# EAGLE design Pedal Box Board rev2.1 (EAGLE 7.7.0)
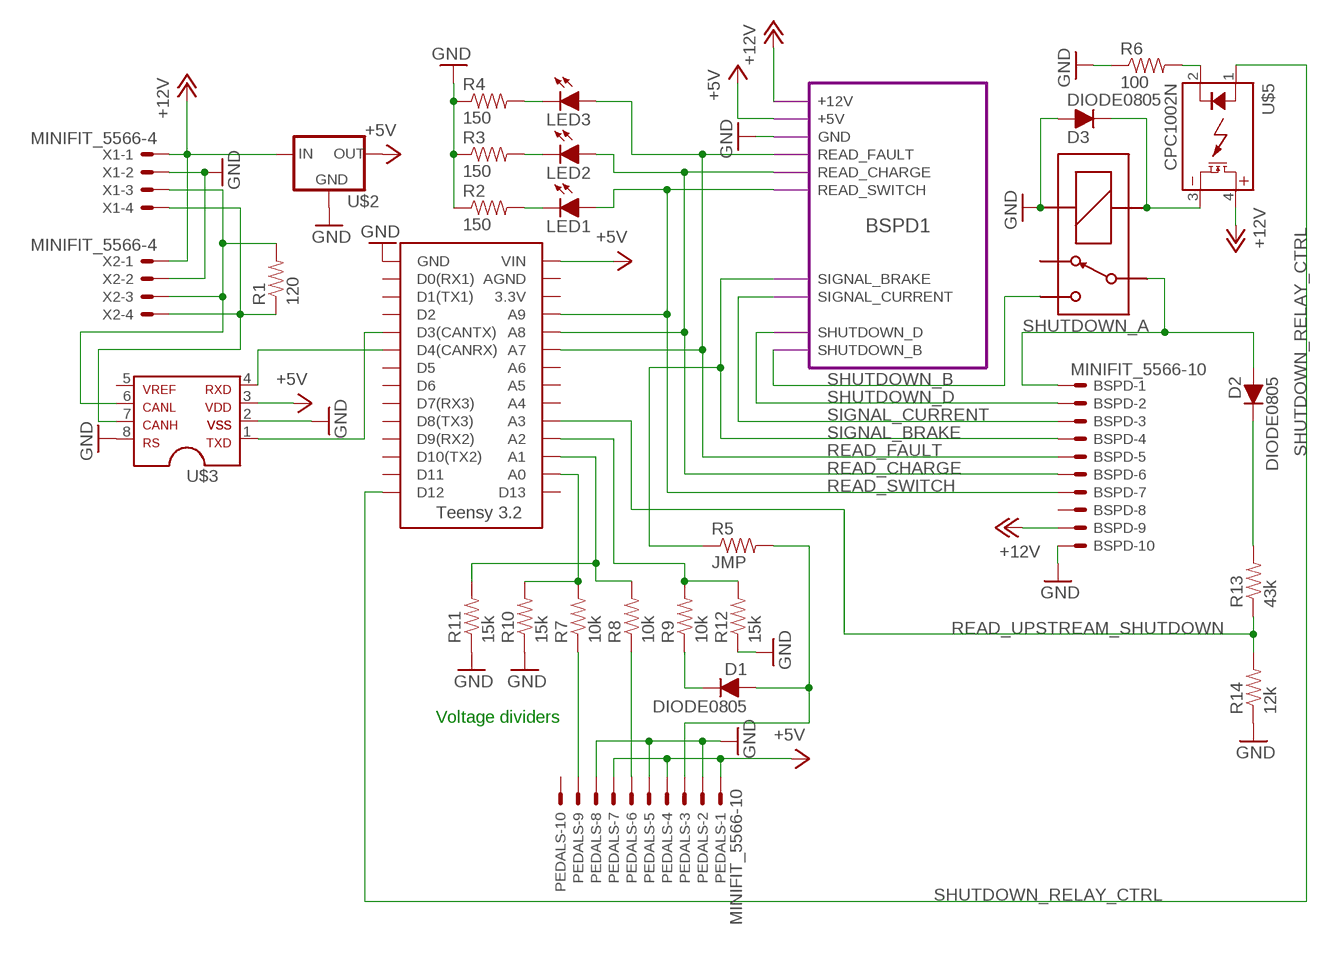
[diagram p0: schematic, sheet 1]

## Parts
BSPD  MINIFIT_5566-10  [MINIFIT_5566-10]
D1  DIODE0805  [0805_D]
D2  DIODE0805  [0805_D]
D3  DIODE0805  [0805_D]
LED1  LED-0805  [LED-805]
LED2  LED-0805  [LED-805]
LED3  LED-0805  [LED-805]
PEDALS  MINIFIT_5566-10  [MINIFIT_5566-10]
R1  120  RESISTOR0805-RES  [0805]
R2  150  RESISTOR0805-RES  [0805]
R3  150  RESISTOR0805-RES  [0805]
R4  150  RESISTOR0805-RES  [0805]
R5  JMP  RESISTORPTH-1/4W-VERT  [AXIAL-0.1]
R6  100  RESISTOR0805-RES  [0805]
R7  10k  RESISTOR0805-RES  [0805]
R8  10k  RESISTOR0805-RES  [0805]
R9  10k  RESISTOR0805-RES  [0805]
R10  15k  RESISTOR0805-RES  [0805]
R11  15k  RESISTOR0805-RES  [0805]
R12  15k  RESISTOR0805-RES  [0805]
R13  43k  RESISTOR0805-RES  [0805]
R14  12k  RESISTOR0805-RES  [0805]
SOFTWARE_SHUTOFF  G5LE  [ZF112]
U$1  TEENSY_3.2_SIMPLE  [TEENSY_3.2_SIMPLE]
U$2  5VREG_LM340-NLM340MPX-5.0/NOPB  [SOT223]
U$3  MCP2551  [SOIC-08]
U$5  CPC1002N  [SOP04]
X1  MINIFIT_5566-4  [MINIFIT_5566-4]
X2  MINIFIT_5566-4  [MINIFIT_5566-4]

## Module instances
BSPD1 = BSPD

## Nets
+5V: PEDALS.1 PEDALS.4 PEDALS.7 U$1.VIN U$2.3(OUT) U$3.3 ; port BSPD1.+5V
+12V: BSPD.9 U$2.1(IN) U$5.4(DC+) X1.1 X2.1 ; port BSPD1.+12V
GND: BSPD.10 D3.A PEDALS.2 PEDALS.5 PEDALS.8 R2.1 R3.1 R4.1 R6.1 R10.1 R11.1 R12.1 R14.1 SOFTWARE_SHUTOFF.1(COIL+) U$1.GND U$2.2(GND) U$2.4(GND) U$3.2 U$3.8 X1.2 X2.2 ; port BSPD1.GND
N$1: PEDALS.9 R7.1
N$2: U$1.D4(CANRX) U$3.4
N$3: R1.2 U$3.6 X1.3 X2.3
N$4: R1.1 U$3.7 X1.4 X2.4
N$5: U$1.D3(CANTX) U$3.1
N$6: R8.2 R11.2 U$1.A1
N$7: D1.C R9.1
N$8: PEDALS.6 R8.1
N$9: R7.2 R10.2 U$1.A0
N$10: R9.2 R12.2 U$1.A2
N$11: D1.A PEDALS.3 R5.P$2
N$12: D3.C SOFTWARE_SHUTOFF.2(COIL-) U$5.3(DC-)
N$13: D2.C R13.2
N$14: LED1.C R2.2
N$15: LED2.C R3.2
N$16: LED3.C R4.2
N$22: R6.2 U$5.2(CONTROL-)
READ_CHARGE: BSPD.6 LED2.A U$1.A8 ; port BSPD1.READ_CHARGE
READ_FAULT: BSPD.5 LED3.A U$1.A7 ; port BSPD1.READ_FAULT
READ_SWITCH: BSPD.7 LED1.A U$1.A9 ; port BSPD1.READ_SWITCH
READ_UPSTREAM_SHUTDOWN: R13.1 R14.2 U$1.A3
SHUTDOWN_A: BSPD.1 D2.A SOFTWARE_SHUTOFF.P
SHUTDOWN_B: SOFTWARE_SHUTOFF.S ; port BSPD1.SHUTDOWN_B
SHUTDOWN_D: BSPD.2 ; port BSPD1.SHUTDOWN_D
SHUTDOWN_RELAY_CTRL: U$1.D12 U$5.1(CONTROL+)
SIGNAL_BRAKE: BSPD.4 R5.P$1 ; port BSPD1.SIGNAL_BRAKE
SIGNAL_CURRENT: BSPD.3 ; port BSPD1.SIGNAL_CURRENT
Unconnected: BSPD.8 PEDALS.10 SOFTWARE_SHUTOFF.O U$1.3.3V U$1.A4 U$1.A5 U$1.A6 U$1.AGND U$1.D0(RX1) U$1.D1(TX1) U$1.D2 U$1.D5 U$1.D6 U$1.D7(RX3) U$1.D8(TX3) U$1.D9(RX2) U$1.D10(TX2) U$1.D11 U$1.D13 U$3.5

## Notes on the sheet
- Voltage dividers

## Library data of the parts
BSPD PEDALS = HyTechDevices:MINIFIT_5566-10: Mini-Fit Junior connector 10 pole Source: http://www.molex.com; OC_FARNELL: unknown; OC_NEWARK: unknown
D1-D3 = HyTechDevices:DIODE: DIODE general purpose rectifier
LED1-LED3 = HyTechDevices:LED: Light Emitting Diode (LED) Source: Dangerous Prototypes Eagle Library <https://github.com/DangerousPrototypes/Eagle_Part_Library>
R1-R14 = HyTechDevices:RESISTOR: Resistor Basic schematic elements and footprints for 0603, 1206, and PTH resistors.
SOFTWARE_SHUTOFF = HyTechDevices:G5LE: Omron G5LE SPST Relay 5 VDC, 12VDC, 24VDC models Coil voltage: 75% - 170% of nominal voltage Datasheet <https://www.omron.com/ecb/products/pdf/en-g5le.pdf>
U$1 = HyTechDevices:TEENSY_3.2_SIMPLE: Simple version of the Teensy 3.2 board that only uses the 2 main rows of pins, not the inner pins or the pins opposite the usb port.
U$2 = HyTechDevices:5VREG_LM340-N: Voltage Regulator 5v linear voltage regulator Datasheet <http://www.mouser.com/ProductDetail/Texas-Instruments/LM340MPX-50-NOPB/?qs=X1J7HmVL2ZGZwtTFRQ9ItA%3D%3D> MAX current out: 1.5A MAX voltage in: 35V
U$3 = HyTechDevices:MCP2551: MCP2551 High-Speed CAN Transceiver Product Webpage <https://www.microchip.com/wwwproducts/en/MCP2551> Datasheet <http://ww1.microchip.com/downloads/en/DeviceDoc/21667f.pdf> This device is outdated It is replaced by MCP2561. Comparison Page <https://www.microchip.com/wwwproducts/ProductCompare/MCP2551/MCP2561> Product Webpage <https://www.microchip.com/wwwproducts/en/MCP2561> Datasheet <http://ww1.microchip.com/downloads/en/DeviceDoc/20005167C.pdf>
U$5 = HyTechDevices:CPC1002N: IXYS Solid State Relay .7A
X1 X2 = HyTechDevices:MINIFIT_5566-4: Mini-Fit Junior connector 4 pole Source: http://www.molex.com; OC_FARNELL: unknown; OC_NEWARK: unknown

## Module BSPD
Ports: GND(out) +5V(in) READ_CHARGE(out) SHUTDOWN_B(in) READ_SWITCH(out) READ_FAULT(out) SHUTDOWN_D(out) SIGNAL_BRAKE(in) SIGNAL_CURRENT(in) +12V(in)
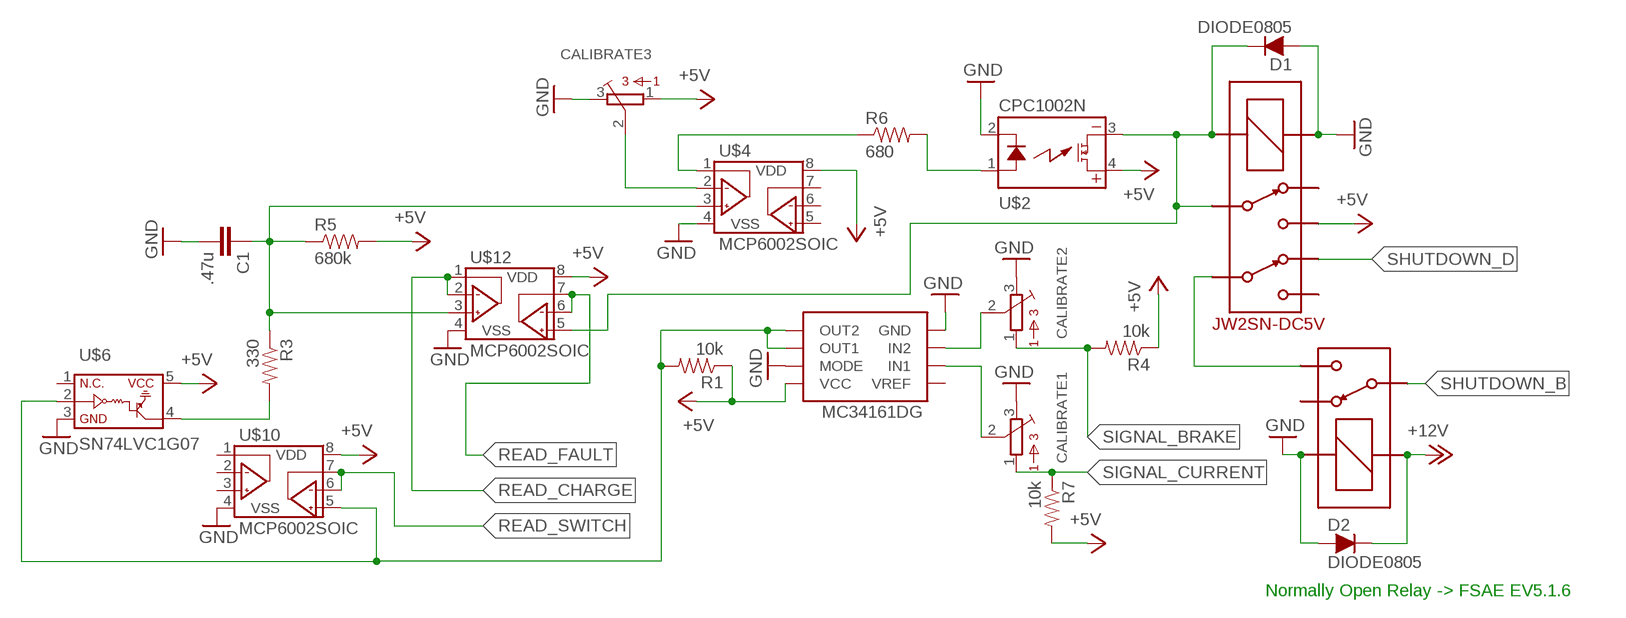
[diagram p1: schematic, module BSPD, sheet 1]

### Parts
C1  .47u  CAPEZ  [CAP-PTH-SMALLEZ]
CALIBRATE1  TRIMPOT_3296C  [TRIMPOT_3296]
CALIBRATE2  TRIMPOT_3296C  [TRIMPOT_3296]
CALIBRATE3  TRIMPOT_3296C  [TRIMPOT_3296]
D1  DIODE0805  [0805_D]
D2  DIODE0805  [0805_D]
MC34161DG  MC34161DG  [SOIC-08]
R1  10k  RESISTOR0805-RES  [0805]
R3  330  RESISTOR0805-RES  [0805]
R4  10k  RESISTOR0805-RES  [0805]
R5  680k  RESISTOREZ  [AXIAL-0.3EZ]
R6  680  RESISTOR0805-RES  [0805]
R7  10k  RESISTOR0805-RES  [0805]
U$1  G5LE  [ZF112]
U$2  CPC1002N  [SOP04]
U$3  JW2SN-DC5V  [JW2SN]
U$4  MCP6002SOIC  [SOIC-08]
U$6  SN74LVC1G07  [SOT-23-5]
U$10  MCP6002SOIC  [SOIC-08]
U$12  MCP6002SOIC  [SOIC-08]

### Nets
+5V: CALIBRATE3.1 MC34161DG.8(VCC) R1.1 R4.1 R5.P$2 R7.2 U$2.4(DC+) U$3.4 U$4.8(VDD) U$6.5 U$10.8(VDD) U$12.8(VDD)
+12V: D2.C U$1.2(COIL-)
GND: C1.2 CALIBRATE1.3 CALIBRATE2.3 CALIBRATE3.3 D1.A D2.A MC34161DG.4(GND) MC34161DG.7(MODE) U$1.1(COIL+) U$2.2(CONTROL-) U$3.COIL+ U$4.4(VSS) U$6.3 U$10.4(VSS) U$12.4(VSS)
N$1: D1.C U$2.3(DC-) U$3.3 U$3.COIL- U$12.5(VINB+)
N$2: R3.2 U$6.4
N$3: R6.2 U$2.1(CONTROL+)
N$5: CALIBRATE2.2 MC34161DG.3(IN2)
N$6: CALIBRATE1.2 MC34161DG.2(IN1)
N$7: CALIBRATE3.2 U$4.2(VINA-)
N$9: R6.1 U$4.1(VOUTA)
N$10: MC34161DG.5(OUT2) MC34161DG.6(OUT1) R1.2 U$6.2 U$10.5(VINB+)
N$13: C1.1 R3.1 R5.P$1 U$4.3(VINA+) U$12.3(VINA+)
READ_CHARGE: U$12.1(VOUTA) U$12.2(VINA-)
READ_FAULT: U$12.6(VINB-) U$12.7(VOUTB)
READ_SWITCH: U$10.6(VINB-) U$10.7(VOUTB)
SHUTDOWN_B: U$1.P
SHUTDOWN_C: U$1.S U$3.6
SHUTDOWN_D: U$3.7
SIGNAL_BRAKE: CALIBRATE2.1 R4.2
SIGNAL_CURRENT: CALIBRATE1.1 R7.1
Unconnected: MC34161DG.1(VREF) U$1.O U$3.2 U$3.5 U$4.5(VINB+) U$4.6(VINB-) U$4.7(VOUTB) U$6.1 U$10.1(VOUTA) U$10.2(VINA-) U$10.3(VINA+)

### Notes on the sheet
- Normally Open Relay -> FSAE EV5.1.6

### Library data of the parts
C1 = HyTechDevices:CAP: Capacitor Standard 0603 ceramic capacitor, and 0.1" leaded capacitor.
CALIBRATE1-CALIBRATE3 = HyTechDevices:TRIMPOT_3296: 3296 Series 3/8" Square Trimmer Source <https://github.com/chiengineer/Eagle-Libraries/blob/master/Potentiometers/bourns.lbr>
D1 D2 = HyTechDevices:DIODE: DIODE general purpose rectifier
MC34161DG = HyTechDevices:MC34161DG: ON Semiconductor MC34161 Dual Channel Voltage Monitor
R1 R3-R7 = HyTechDevices:RESISTOR: Resistor Basic schematic elements and footprints for 0603, 1206, and PTH resistors.
U$1 = HyTechDevices:G5LE: Omron G5LE SPST Relay 5 VDC, 12VDC, 24VDC models Coil voltage: 75% - 170% of nominal voltage Datasheet <https://www.omron.com/ecb/products/pdf/en-g5le.pdf>
U$2 = HyTechDevices:CPC1002N: IXYS Solid State Relay .7A
U$3 = HyTechDevices:JW2SN-DC5V: Panasonic Double Pull Double Throw Relay 5VDC Datasheet <http://www.mouser.com/ds/2/316/jw-catalog-461998.pdf> Product Page <http://www.mouser.com/ProductDetail/Panasonic-Industrial-Devices/JW2SN-DC5V>
U$4 U$10 U$12 = HyTechDevices:MCP6002: Microchip MCP6002 Dual Channel Op Amp
U$6 = HyTechDevices:SN74LVC1G07: TI SN74LVC1G07 Single Buffer/Driver With Open-Drain Output Datasheet <http://www.ti.com/lit/ds/symlink/sn74lvc1g07.pdf>

## Board
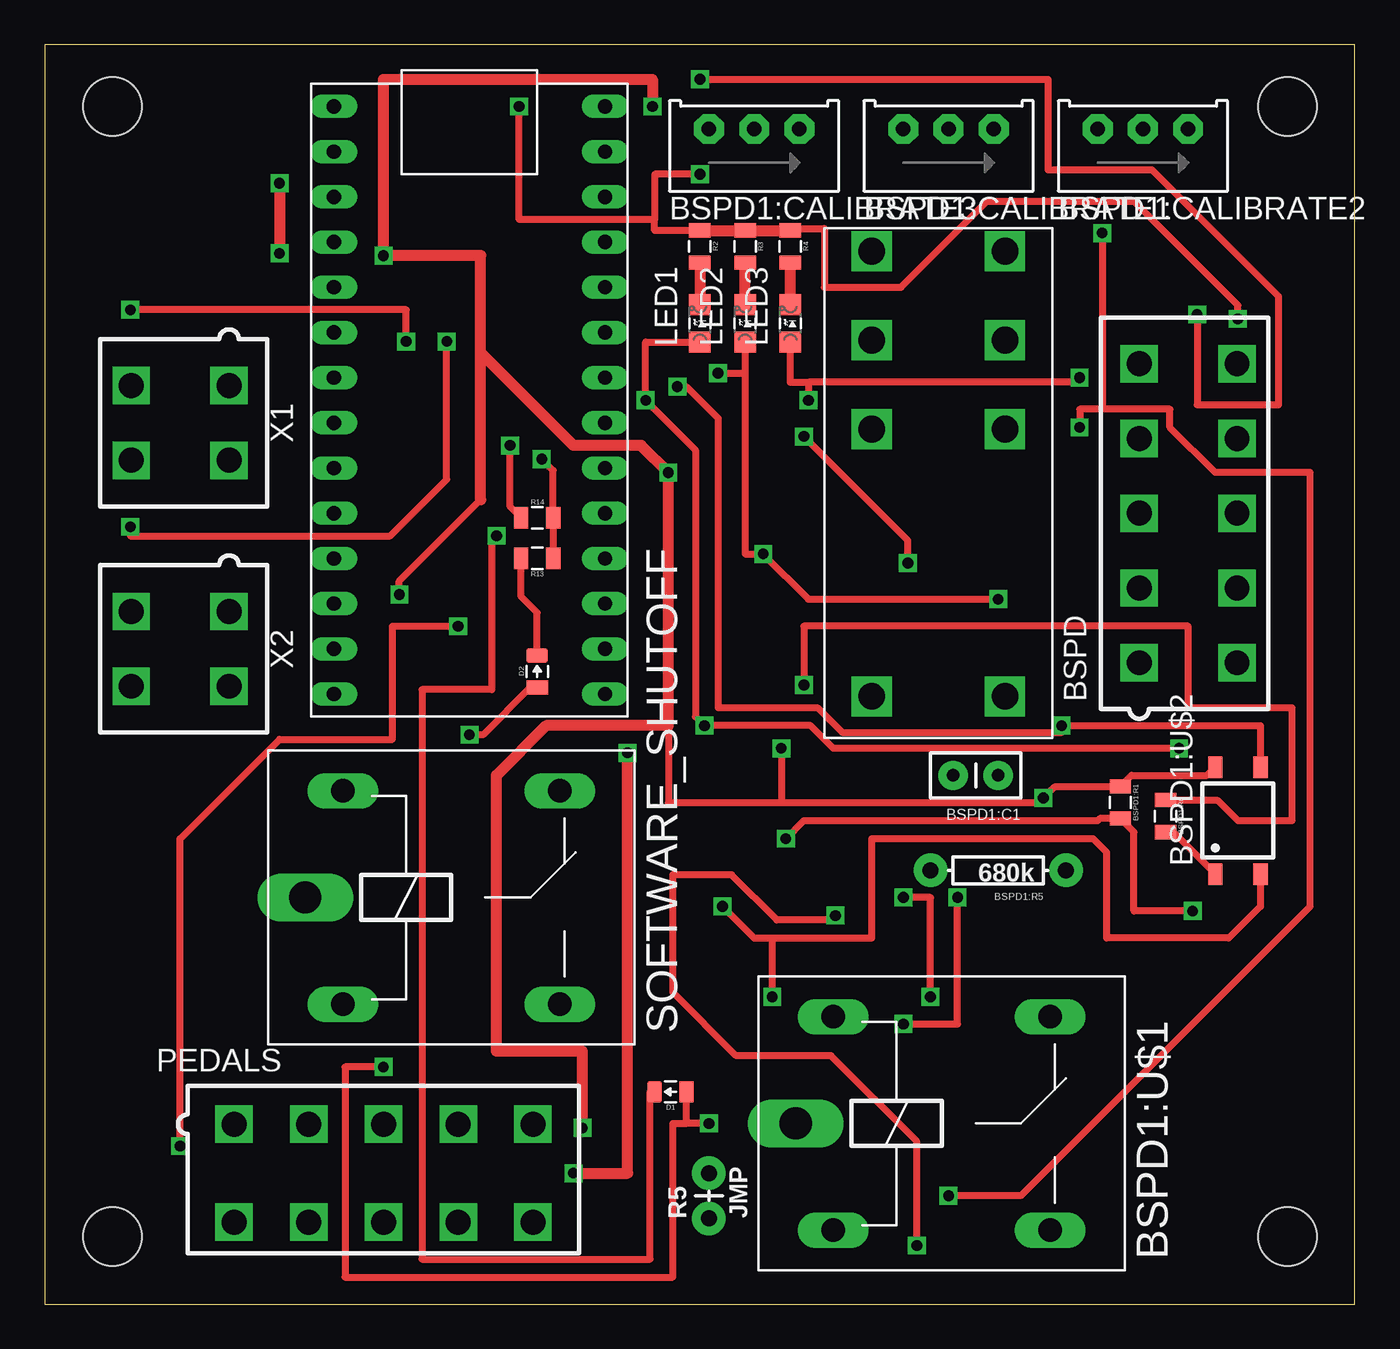
[diagram p2: board, top side]
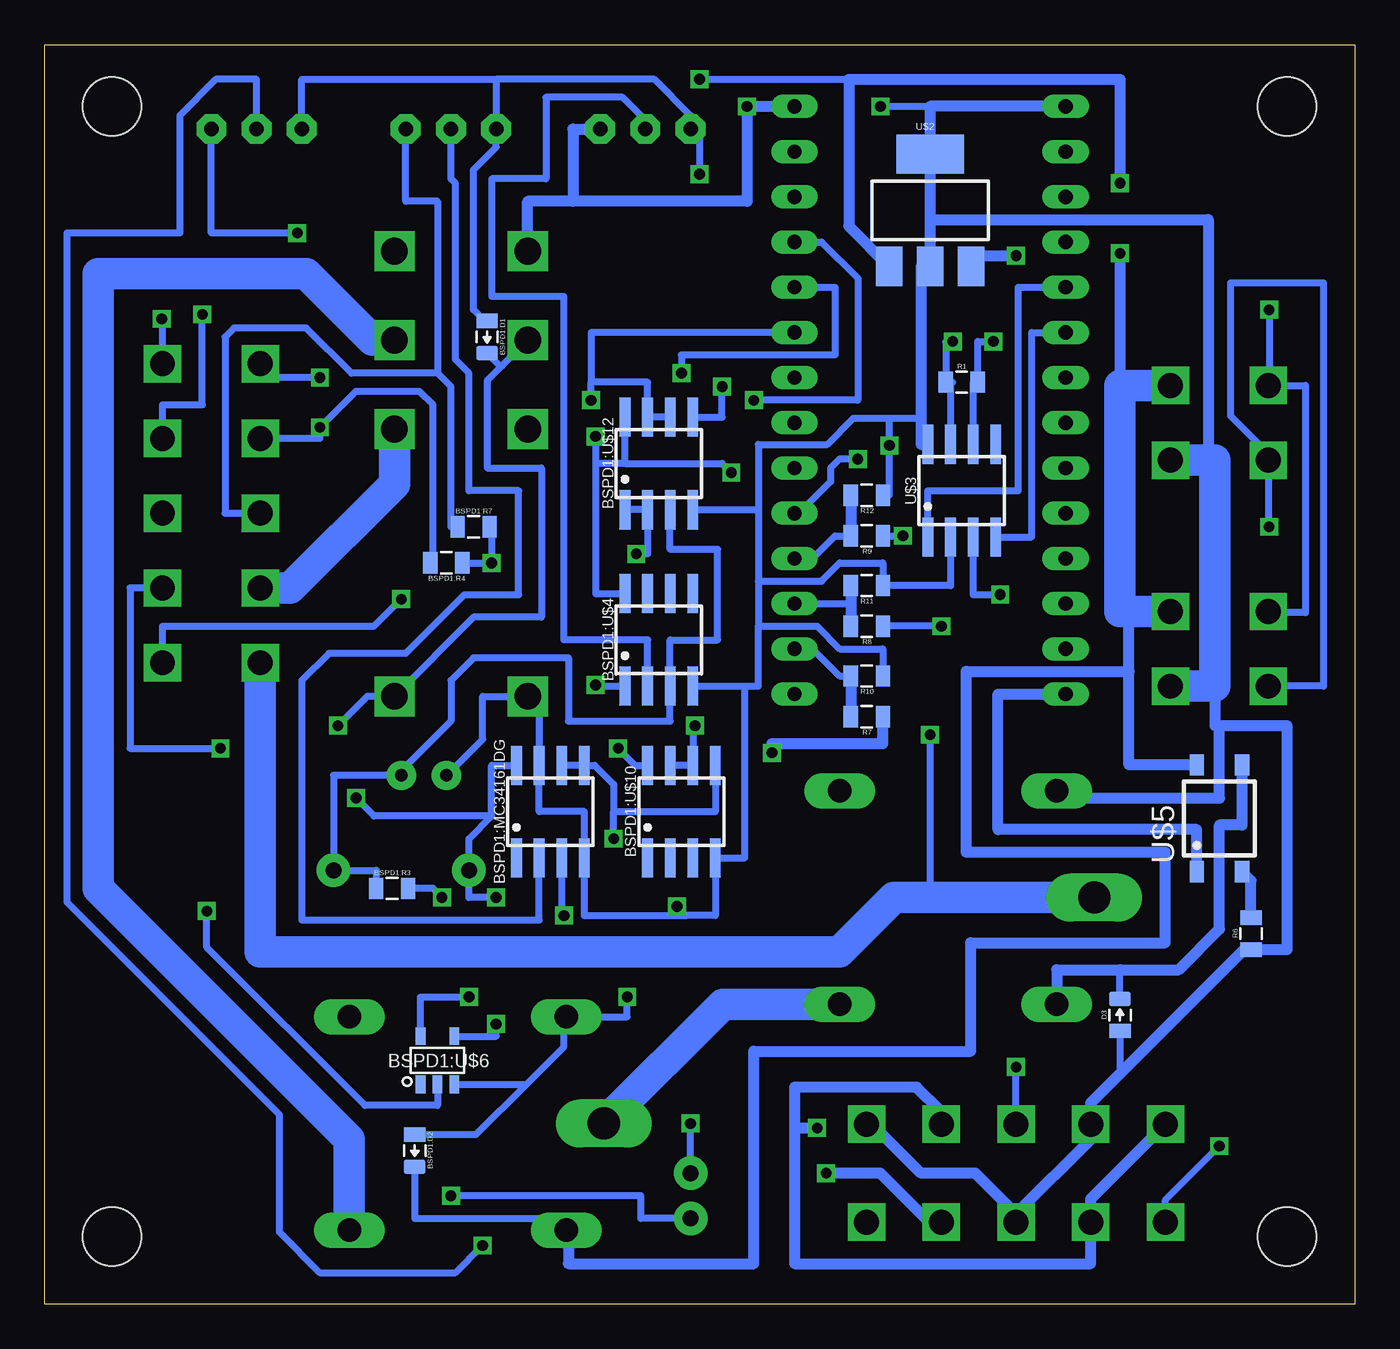
[diagram p3: board, bottom side, seen from below]

Size 73.64 x 70.79 mm. Coordinates in mm from the lower left corner, seen from the top.
Outline: 0,0 73.64,0 73.64,70.79 0,70.79 0,0
Copper layers (1*16): Top 0.035mm / dielectric 1.5mm / Bottom 0.035mm
Design rules "default": minimum track width 10mil, minimum drill 24mil, track to track 8mil, track to pad 8mil, pad to pad 8mil, via to via 8mil, smd to smd 8mil, copper to edge 40mil, drill to drill 8mil, minimum pad ring 10mil, minimum via ring 8mil, stop-mask expansion 4mil, vias tented up to drill 0mil, thermal gap 10mil
Holes 3.3 mm at 3.81,67.31 69.85,67.31 69.85,3.81 3.81,3.81

### Footprints (pad centres in the part's own frame; a part is rotated, then mirrored left to right if it is on the bottom)
MINIFIT_5566-10 = drill 1.4 square: 1 8.4,-2.75; 2 4.2,-2.75; 3 0,-2.75; 4 -4.2,-2.75; 5 -8.4,-2.75; 6 8.4,2.75; 7 4.2,2.75; 8 0,2.75; 9 -4.2,2.75; 10 -8.4,2.75
CAP-PTH-SMALLEZ = drill 0.7 pad 1.651: 1 0,0; 2 2.54,0
TRIMPOT_3296 = drill 0.813 pad 1.676 octagon: 1 2.54,1.27; 2 0,1.27; 3 -2.54,1.27
0805_D = smd 0.8 x 1.2: A -0.9,0; C 0.9,0
SOIC-08 = smd 0.6 x 2.2: 1 -1.905,-2.6; 2 -0.635,-2.6; 3 0.635,-2.6; 4 1.905,-2.6; 5 1.905,2.6; 6 0.635,2.6; 7 -0.635,2.6; 8 -1.905,2.6
0805 = smd 0.8 x 1.2: 1 -0.9,0; 2 0.9,0
AXIAL-0.3EZ = drill 0.9 pad 1.88: P$1 -3.81,0; P$2 3.81,0
ZF112 = drill 1.321 long: 1 4.064,14.884; 2 4.064,2.896; O 16.256,14.884; S 16.256,2.896 | drill 1.803 long: P 1.956,8.89
SOP04 = smd 0.8 x 1.2: 1 -1.27,-3; 2 1.27,-3; 3 1.27,3; 4 -1.27,3
JW2SN = drill 1.5 square: 2 10.008,0; 3 5.004,0; 4 0,0; 5 0,7.493; 6 5.004,7.493; 7 10.008,7.493; COIL+ 25.019,0; COIL- 25.019,7.493
SOT-23-5 = smd 1 x 0.55: 1 -1.35,0.95; 2 -1.35,0; 3 -1.35,-0.95; 4 1.35,-0.95; 5 1.35,0.95
LED-805 = smd 1.2 x 1.2: A 0,-1.05; C 0,1.05
AXIAL-0.1 = drill 0.9 pad 1.88: P$1 0,0; P$2 2.54,0
TEENSY_3.2_SIMPLE = drill 0.8 long: 3.3V 16.51,29.21; A0 16.51,3.81; A1 16.51,6.35; A2 16.51,8.89; A3 16.51,11.43; A4 16.51,13.97; A5 16.51,16.51; A6 16.51,19.05; A7 16.51,21.59; A8 16.51,24.13; A9 16.51,26.67; AGND 16.51,31.75; D0(RX1) 1.27,31.75; D1(TX1) 1.27,29.21; D2 1.27,26.67; D3(CANTX) 1.27,24.13; D4(CANRX) 1.27,21.59; D5 1.27,19.05; D6 1.27,16.51; D7(RX3) 1.27,13.97; D8(TX3) 1.27,11.43; D9(RX2) 1.27,8.89; D10(TX2) 1.27,6.35; D11 1.27,3.81; D12 1.27,1.27; D13 16.51,1.27; GND 1.27,34.29; VIN 16.51,34.29
SOT223 = smd 1.5 x 2.235: 1 -2.3,-3.15; 2 0,-3.15; 3 2.3,-3.15 | smd 3.8 x 2.2: 4 0,3.15
MINIFIT_5566-4 = drill 1.4 square: 1 2.1,-2.75; 2 -2.1,-2.75; 3 2.1,2.75; 4 -2.1,2.75

### Placement (x,y rotation side)
BSPD  64.26,44.45 270 top
BSPD1:C1  .47u  [CAP-PTH-SMALLEZ]  53.59,29.72 180 top
BSPD1:CALIBRATE1  [TRIMPOT_3296]  50.8,64.77 0 top
BSPD1:CALIBRATE2  [TRIMPOT_3296]  61.72,64.77 0 top
BSPD1:CALIBRATE3  [TRIMPOT_3296]  39.88,64.77 0 top
BSPD1:D1  DIODE0805  [0805_D]  48.77,54.36 270 bottom
BSPD1:D2  DIODE0805  [0805_D]  52.83,8.64 270 bottom
BSPD1:MC34161DG  [SOIC-08]  45.21,27.69 0 bottom
BSPD1:R1  10k  [0805]  60.45,28.19 270 top
BSPD1:R3  330  [0805]  54.1,23.37 0 bottom
BSPD1:R4  10k  [0805]  51.05,41.66 180 bottom
BSPD1:R5  680k  [AXIAL-0.3EZ]  53.59,24.38 180 top
BSPD1:R6  680  [0805]  62.99,27.43 270 top
BSPD1:R7  10k  [0805]  49.53,43.69 0 bottom
BSPD1:U$1  G5LE  [ZF112]  40.26,1.27 0 top
BSPD1:U$2  CPC1002N  [SOP04]  67.06,27.18 0 top
BSPD1:U$3  JW2SN-DC5V  [JW2SN]  46.48,59.18 270 top
BSPD1:U$4  MCP6002SOIC  [SOIC-08]  39.12,37.34 0 bottom
BSPD1:U$6  SN74LVC1G07  [SOT-23-5]  51.56,13.72 90 bottom
BSPD1:U$10  MCP6002SOIC  [SOIC-08]  37.85,27.69 0 bottom
BSPD1:U$12  MCP6002SOIC  [SOIC-08]  39.12,47.24 0 bottom
D1  35.18,11.94 180 top
D2  27.69,35.56 90 top
D3  13.21,16.26 90 bottom
LED1  36.83,55.12 0 top
LED2  39.37,55.12 0 top
LED3  41.91,55.12 0 top
PEDALS  19.05,7.37 180 top
R1  22.1,51.82 0 bottom
R2  36.83,59.44 270 top
R3  39.37,59.44 270 top
R4  41.91,59.44 270 top
R5  37.34,4.83 90 top
R6  5.84,20.83 90 bottom
R7  27.43,33.02 180 bottom
R8  27.43,38.1 180 bottom
R9  27.43,43.18 180 bottom
R10  27.43,35.31 180 bottom
R11  27.43,40.39 180 bottom
R12  27.43,45.47 180 bottom
R13  27.69,41.91 180 top
R14  27.69,44.2 0 top
SOFTWARE_SHUTOFF  12.7,13.97 0 top
U$1  14.99,33.02 0 top
U$2  23.88,61.47 0 bottom
U$3  22.1,45.72 0 bottom
U$5  7.62,27.3 0 bottom
X1  7.62,49.53 90 top
X2  7.62,36.83 90 top

### Tracks (layer width: path | path; a pad name or v marks a point on that pad's centre or on a via)
+5V  (via drill 0.6)
  Top 0.406: v19.94,39.88 19.94,40.64 24.51,45.21 | 35.05,32.51 35.05,28.19 41.4,28.19 | v41.4,31.24 41.4,28.19 | 41.4,28.19 55.88,28.19 v56.13,28.45 56.78,29.09 BSPD1:R1.1 61.08,29.72 65.33,29.72 BSPD1:U$2.4 | v48.51,41.66 48.51,42.93 v42.67,48.77 | v49.78,17.27 49.78,22.86 v48.26,22.86
  Top 0.61: v34.16,67.31 34.16,68.83 19.05,68.83 v19.05,58.93 24.51,58.93 24.51,53.47 | 24.51,45.21 24.51,53.47 | v30.23,9.91 30.23,14.22 25.4,14.22 25.4,29.72 28.19,32.51 35.05,32.51 v35.05,46.74 33.53,48.26 29.72,48.26 24.51,53.47
  Bottom 0.406: U$3.3 21.46,39.88 v19.94,39.88 | 48.51,27.43 48.51,30.29 BSPD1:MC34161DG.8 | 48.51,27.43 55.12,27.43 v56.13,28.45 | v41.4,31.24 40.45,30.29 BSPD1:U$10.8 | 41.02,47.24 BSPD1:U$12.8 | 41.02,47.24 42.67,47.24 | 42.67,47.24 42.67,39.94 BSPD1:U$4.8 | 48.51,27.43 49.78,26.16 BSPD1:R5.P$2 49.78,22.86 v48.26,22.86 | BSPD1:R4.1 v48.51,41.66 48.51,43.69 BSPD1:R7.2 | v42.67,48.77 42.67,47.24 | 41.02,47.24 35.56,47.24 v35.05,46.74 | BSPD1:U$6.5 52.51,17.27 v49.78,17.27
  Bottom 0.61: PEDALS.1 14.85,5.92 PEDALS.7 14.85,2.29 31.5,2.29 31.5,9.91 | PEDALS.4 23.25,10.8 24.64,12.19 31.5,12.19 31.5,9.91 | U$2.3 21.58,58.93 v19.05,58.93 | U$1.VIN v34.16,67.31 34.16,61.98 43.94,61.98 | 31.5,9.91 v30.23,9.91 | 43.94,61.98 46.48,61.98 BSPD1:U$3.4 | 43.94,61.98 43.94,66.04 BSPD1:CALIBRATE3.1
+12V  (via drill 0.6)
  Top 0.406: v64.77,55.63 64.77,50.55 69.34,50.55 69.34,56.64 62.23,63.75 56.39,63.75 56.39,68.83 v36.83,68.83
  Top 0.61: v13.21,62.99 v13.21,59.05
  Bottom 0.406: BSPD.9 67.01,50.55 64.77,50.55 v64.77,55.63 | v36.83,68.83 28.45,68.83 | BSPD1:D2.C 52.83,4.83 44.32,4.83 BSPD1:U$1.2
  Bottom 0.61: U$5.4 12.7,30.3 12.7,35.56 | v13.21,62.99 13.21,68.83 28.45,68.83 28.45,60.59 U$2.1 | v13.21,59.05 13.21,51.63 | BSPD1:U$1.2 44.2,4.17 44.2,2.29 33.78,2.29 33.78,14.22 21.59,14.22 21.59,20.32 10.67,20.32 10.67,25.4 21.84,25.4 21.84,35.56 12.7,35.56 | 12.7,35.56 12.7,38.93 12.83,38.93
  Bottom 1.778: X1.1 13.21,51.63 13.21,38.93 12.83,38.93 X2.1
BSPD1:N$1  (via drill 0.6)
  Top 0.406: BSPD1:U$2.3 68.33,32.51 v57.15,32.51 57.15,32.13 44.83,32.13 43.43,33.53 37.85,33.53 37.85,49.78 36.07,51.56 v35.56,51.56
  Bottom 0.406: 47.92,52.74 48.77,51.89 48.77,46.99 45.72,46.99 45.72,38.61 49.53,38.61 BSPD1:U$3.COIL- 55.5,34.16 v57.15,32.51 | 47.92,52.74 BSPD1:U$3.3 | BSPD1:U$12.5 35.56,49.84 v35.56,51.56 | BSPD1:D1.C 48.05,52.74 47.92,52.74
BSPD1:N$2  (via drill 0.6)
  Top 0.406: v48.26,15.75 51.31,15.75 v51.31,22.86
  Bottom 0.406: v51.31,22.86 51.82,23.37 BSPD1:R3.2 | BSPD1:U$6.4 48.26,15.07 v48.26,15.75
BSPD1:N$3
  Top 0.406: BSPD1:R6.2 63.43,26.53 BSPD1:U$2.1
BSPD1:N$5  (via drill 0.6)
  Top 0.406: v44.45,21.84 44.45,21.59 41.15,21.59 38.61,24.13 35.31,24.13 35.31,17.53 38.86,13.97 44.2,13.97 49.02,9.14 v49.02,3.3
  Bottom 0.406: BSPD1:MC34161DG.3 44.58,21.84 v44.45,21.84 | BSPD1:CALIBRATE2.2 61.72,68.83 64.01,68.83 66.04,66.8 66.04,60.2 72.39,60.2 72.39,22.61 60.45,10.67 60.45,4.06 58.17,1.78 50.55,1.78 v49.02,3.3
BSPD1:N$6
  Bottom 0.406: BSPD1:MC34161DG.2 45.85,21.59 59.18,21.59 59.18,35.05 57.66,36.58 53.34,36.58 50.04,39.88 46.99,39.88 46.99,45.72 49.78,45.72 49.78,52.32 50.55,53.09 50.55,62.99 50.8,63.25 BSPD1:CALIBRATE1.2
BSPD1:N$7
  Bottom 0.406: BSPD1:U$4.2 39.75,37.34 44.45,37.34 44.45,56.64 48.51,56.64 48.51,63.25 45.47,63.25 45.47,67.82 41.15,67.82 39.88,66.55 BSPD1:CALIBRATE3.2
BSPD1:N$9  (via drill 0.6)
  Top 0.406: v42.67,34.8 42.67,38.1 64.26,38.1 64.26,33.53 70.1,33.53 70.1,27.18 67.06,27.18 65.9,28.33 BSPD1:R6.1
  Bottom 0.406: v42.67,34.8 42.67,34.74 BSPD1:U$4.1
BSPD1:N$10  (via drill 0.6)
  Top 0.406: v64.52,22.1 61.21,22.1 61.21,26.53 BSPD1:R1.2 59.3,27.29 59.18,27.18 42.67,27.18 v41.66,26.16
  Bottom 0.406: BSPD1:U$10.5 35.94,27.69 41.66,27.69 | BSPD1:MC34161DG.6 BSPD1:MC34161DG.5 42.73,30.29 41.66,29.21 41.66,27.69 | v41.66,26.16 41.66,27.69 | v64.52,22.1 64.52,20.07 55.63,11.18 51.56,11.18 BSPD1:U$6.2
BSPD1:N$13
  Bottom 0.406: BSPD1:R3.1 55,24.38 BSPD1:R5.P$1 57.4,29.72 BSPD1:C1.1 53.59,29.97 50.8,32.77 50.8,35.05 49.53,36.32 44.2,36.32 44.2,32.77 38.48,32.77 BSPD1:U$4.3 38.48,37.34 35.81,37.34 35.81,42.42 38.48,42.42 BSPD1:U$12.3
BSPD1:SHUTDOWN_C
  Bottom 1.778: BSPD1:U$3.6 55.19,54.18 58.93,57.91 70.61,57.91 70.61,23.37 56.52,9.27 BSPD1:U$1.S
GND  (via drill 0.6)
  Top 0.406: 34.29,60.96 26.67,60.96 v26.67,67.31 | v67.06,55.37 67.06,56.13 61.21,61.98 52.96,61.98 48.13,57.15 43.81,57.15 43.81,60.45 42.03,60.45 R4.1 | BSPD1:U$2.2 68.33,22.35 66.55,20.57 59.69,20.57 59.69,25.4 58.93,26.16 46.48,26.16 46.48,20.57 40.89,20.57 | v38.1,22.35 39.88,20.57 40.89,20.57 | v36.83,63.5 34.29,63.5 34.29,60.96 | R2.1 34.29,60.34 34.29,60.96 | v40.89,17.27 40.89,20.57 | R14.1 26.16,44.82 v26.16,48.26
  Top 0.61: R2.1 R3.1 R4.1
  Bottom 0.406: R12.1 26.16,45.47 v26.16,48.26 26.16,49.78 | 33.53,44.64 33.53,40.64 | 33.53,40.64 29.97,40.64 28.96,41.66 26.53,41.66 R11.1 22.73,40.39 U$3.2 | 33.53,40.64 33.53,38.1 | 33.53,38.1 30.23,38.1 28.96,36.83 26.53,36.83 R10.1 | v26.67,67.31 23.88,67.31 | 48.26,68.83 59.18,68.83 BSPD1:CALIBRATE2.3 | 48.26,68.83 BSPD1:CALIBRATE1.3 48.26,65.02 49.53,63.75 49.53,55.88 48.91,55.26 BSPD1:D1.A | 48.26,68.83 39.37,68.83 37.34,66.8 BSPD1:CALIBRATE3.3 36.83,66.04 v36.83,63.5 | BSPD.10 67.01,55.37 v67.06,55.37 | 33.53,38.1 33.53,34.74 34.29,34.74 | 34.29,34.74 34.29,25.09 BSPD1:U$10.4 35.94,21.84 37.59,21.84 | BSPD1:C1.2 49.02,31.75 49.02,34.16 BSPD1:U$3.COIL+ 45.85,34.16 BSPD1:MC34161DG.7 45.85,27.69 43.31,27.69 BSPD1:MC34161DG.4 43.31,21.84 37.59,21.84 | BSPD1:U$12.4 33.53,44.64 | BSPD1:U$4.4 34.29,34.74 | 37.59,21.84 v38.1,22.35 | v40.89,17.27 40.89,16.15 BSPD1:U$1.1 44.45,16.03 44.45,14.48 46.56,12.37 | 33.53,44.64 33.53,48.32 29.66,48.32 28.19,49.78 26.16,49.78 | 26.16,49.78 24.64,49.78 24.38,49.53 | BSPD1:U$6.3 46.56,12.37 | D3.A 13.21,12.95 | BSPD1:D2.A 49.39,9.54 46.56,12.37
  Bottom 0.61: 7.62,32.51 3.81,32.51 3.81,19.93 R6.1 6.23,19.93 13.21,12.95 14.85,11.31 PEDALS.2 14.85,9.28 19.05,5.08 | 19.05,5.08 PEDALS.8 | 19.05,5.08 21.34,7.37 24.38,7.37 27.13,10.12 PEDALS.5 | U$1.GND 23.88,67.31 U$2.4 23.88,60.96 | 23.88,60.96 U$2.2 24.38,58.32 24.38,49.53 24.38,48.32 U$3.8 | 23.88,60.96 8.26,60.96 8.26,47.43 | SOFTWARE_SHUTOFF.1 16.76,28.45 7.62,28.45 7.62,32.51 | 7.87,34.73 7.87,32.51 7.62,32.51
  Bottom 1.778: X2.2 7.87,34.73 7.87,47.43 8.26,47.43 X1.2
N$1  (via drill 0.6)
  Top 0.61: v29.72,7.37 32.77,7.37 v32.77,30.99
  Bottom 0.61: PEDALS.9 23.92,4.62 26.67,7.37 v29.72,7.37 | R7.1 26.53,31.5 32.77,31.5 v32.77,30.99
N$2
  Bottom 0.406: U$3.4 18.16,43.12 18.16,54.61 U$1.D4(CANRX)
N$3  (via drill 0.6)
  Top 0.406: v20.32,54.1 20.32,55.88 v4.83,55.88
  Bottom 0.406: 4.87,38.86 2.79,38.86 2.79,51.63 X1.3 4.83,51.63 v4.83,55.88 | U$3.6 21.46,51.82 R1.2 21.2,54.1 v20.32,54.1
  Bottom 0.61: 4.87,38.86 X2.3
N$4  (via drill 0.6)
  Top 0.406: v4.83,43.69 4.83,43.18 19.43,43.18 22.61,46.35 v22.61,54.1
  Bottom 0.406: 22.73,51.82 U$3.7 | 22.61,51.82 22.73,51.82 | 22.73,51.82 R1.1 23,54.09 v22.61,54.1 | X2.4 1.78,34.73 1.78,57.4 6.99,57.4 6.99,49.91 4.87,47.8 X1.4 4.87,43.69 v4.83,43.69
N$5
  Bottom 0.406: U$3.1 24,45.72 18.92,45.72 18.92,57.15 U$1.D3(CANTX)
N$6
  Bottom 0.406: U$1.A1 28.33,39.37
  Bottom 0.61: R11.2 28.33,39.37 R8.2
N$7  (via drill 0.6)
  Top 0.406: D1.C 34.04,11.94 34.04,2.54 21.21,2.54 21.21,34.54 25.15,34.54 25.15,43.18 v25.4,43.18
  Bottom 0.406: R9.1 v25.4,43.18
N$8  (via drill 0.6)
  Top 0.406: v23.24,38.1 19.56,38.1 19.56,31.75 13.21,31.75 7.62,26.16 v7.62,8.89
  Bottom 0.406: v23.24,38.1 R8.1 | PEDALS.6 10.65,5.86 v7.62,8.89
N$9
  Bottom 0.406: U$1.A0 30.48,36.83 28.96,35.31 R10.2
  Bottom 0.61: R10.2 R7.2
N$10
  Bottom 0.406: U$1.A2 30.48,41.91 29.21,43.18 R9.2
  Bottom 0.61: R12.2 R9.2
N$11  (via drill 0.6)
  Top 0.406: v19.05,13.34 16.89,13.34 16.89,1.52 35.31,1.52 35.31,10.16 36.07,10.16 | 36.07,10.16 36.07,11.94 D1.A | v37.34,10.16 36.07,10.16
  Bottom 0.406: PEDALS.3 v19.05,13.34 | R5.P$2 v37.34,10.16
N$12
  Bottom 0.406: D3.C 13.21,18.8
  Bottom 0.61: SOFTWARE_SHUTOFF.2 16.76,18.8 13.21,18.8 9.91,18.8 7.62,21.08 7.62,26.92 6.35,26.92 U$5.3
N$13
  Top 0.406: D2.C 27.69,38.86 26.79,39.76 R13.2
N$14
  Top 0.61: R2.2 LED1.C
N$15
  Top 0.61: LED2.C R3.2
N$16
  Top 0.61: LED3.C R4.2
N$22
  Bottom 0.61: R6.2 5.84,23.8 U$5.2
READ_CHARGE  (via drill 0.6)
  Top 0.406: LED2.A 39.37,52.32 | 39.37,52.32 39.37,42.16 v40.39,42.16 42.93,39.62 v53.59,39.62 | v37.85,52.32 39.37,52.32
  Bottom 0.406: BSPD1:U$12.1 BSPD1:U$12.2 39.75,42.16 v40.39,42.16 | U$1.A8 29.21,57.15 29.21,53.34 37.85,53.34 v37.85,52.32 | BSPD.6 67.01,38.1 55.12,38.1 v53.59,39.62
READ_FAULT  (via drill 0.6)
  Top 0.406: LED3.A 41.91,51.82 42.93,51.82 | 42.93,51.82 v42.93,50.8 | 42.93,51.82 57.91,51.82 v58.17,52.07
  Bottom 0.406: U$1.A7 42.93,54.61 42.93,51.82 | BSPD1:U$12.6 BSPD1:U$12.7 39.75,51.82 42.93,51.82 | v42.93,50.8 42.93,51.82 | v58.17,52.07 60.73,52.07 BSPD.5
READ_SWITCH  (via drill 0.6)
  Top 0.406: v63.75,31.24 44.32,31.24 43.05,32.51 v37.08,32.51 36.58,33.02 36.58,48.01 v33.78,50.8 33.78,54.07 LED1.A
  Bottom 0.406: BSPD1:U$10.7 BSPD1:U$10.6 37.21,32.51 v37.08,32.51 | U$1.A9 29.97,59.69 27.94,57.66 27.94,50.8 v33.78,50.8 | BSPD.7 68.83,40.25 68.83,31.24 v63.75,31.24
READ_UPSTREAM_SHUTDOWN  (via drill 0.6)
  Top 0.406: R13.1 R14.2 28.59,46.85 v27.94,47.5
  Bottom 0.406: U$1.A3 31.24,44.45 29.46,46.23 29.46,46.99 28.96,47.5 v27.94,47.5
SHUTDOWN_A  (via drill 0.6)
  Top 0.406: D2.A 27.29,34.66 24.64,32 v23.88,32
  Bottom 0.406: v23.88,32 23.88,22.86
  Bottom 1.778: BSPD.1 61.51,19.81 28.96,19.81 25.91,22.86 23.88,22.86 SOFTWARE_SHUTOFF.P
SHUTDOWN_B
  Bottom 1.778: BSPD1:U$1.P 35.51,16.87 SOFTWARE_SHUTOFF.S
SHUTDOWN_D
  Bottom 1.778: BSPD.2 59.83,40.25 53.98,46.1 BSPD1:U$3.7
SHUTDOWN_RELAY_CTRL
  Bottom 0.61: U$5.1 8.89,26.67 20.07,26.67 20.07,34.29 U$1.D12
SIGNAL_BRAKE  (via drill 0.6)
  Top 0.406: v58.17,49.28 58.17,50.29 59.44,50.29 | 59.44,50.29 63.25,50.29 63.25,49.28 65.79,46.74 71.12,46.74 71.12,22.35 54.86,6.1 v50.8,6.1 | v59.44,60.2 59.44,50.29
  Bottom 0.406: R5.P$1 40.13,4.83 40.13,6.1 v50.8,6.1 | BSPD.4 58.17,48.65 v58.17,49.28 56.13,51.31 52.58,51.31 51.82,50.55 51.82,41.66 BSPD1:R4.2 | v59.44,60.2 64.26,60.2 BSPD1:CALIBRATE2.1
SIGNAL_CURRENT
  Bottom 0.406: 51.56,52.32 51.56,61.98 53.34,61.98 BSPD1:CALIBRATE1.1 | BSPD.3 63.5,44.45 63.5,54.36 62.99,54.86 58.93,54.86 56.39,52.32 51.56,52.32 | BSPD1:R7.1 50.8,43.69 50.8,51.56 51.56,52.32

### Text on the board
tDocu: hytech_2017 | SW | CH | FAULT | pedal_board | rev2.1